# EAGLE design PC104 ISA TEMPLATE (EAGLE 8.5.0)
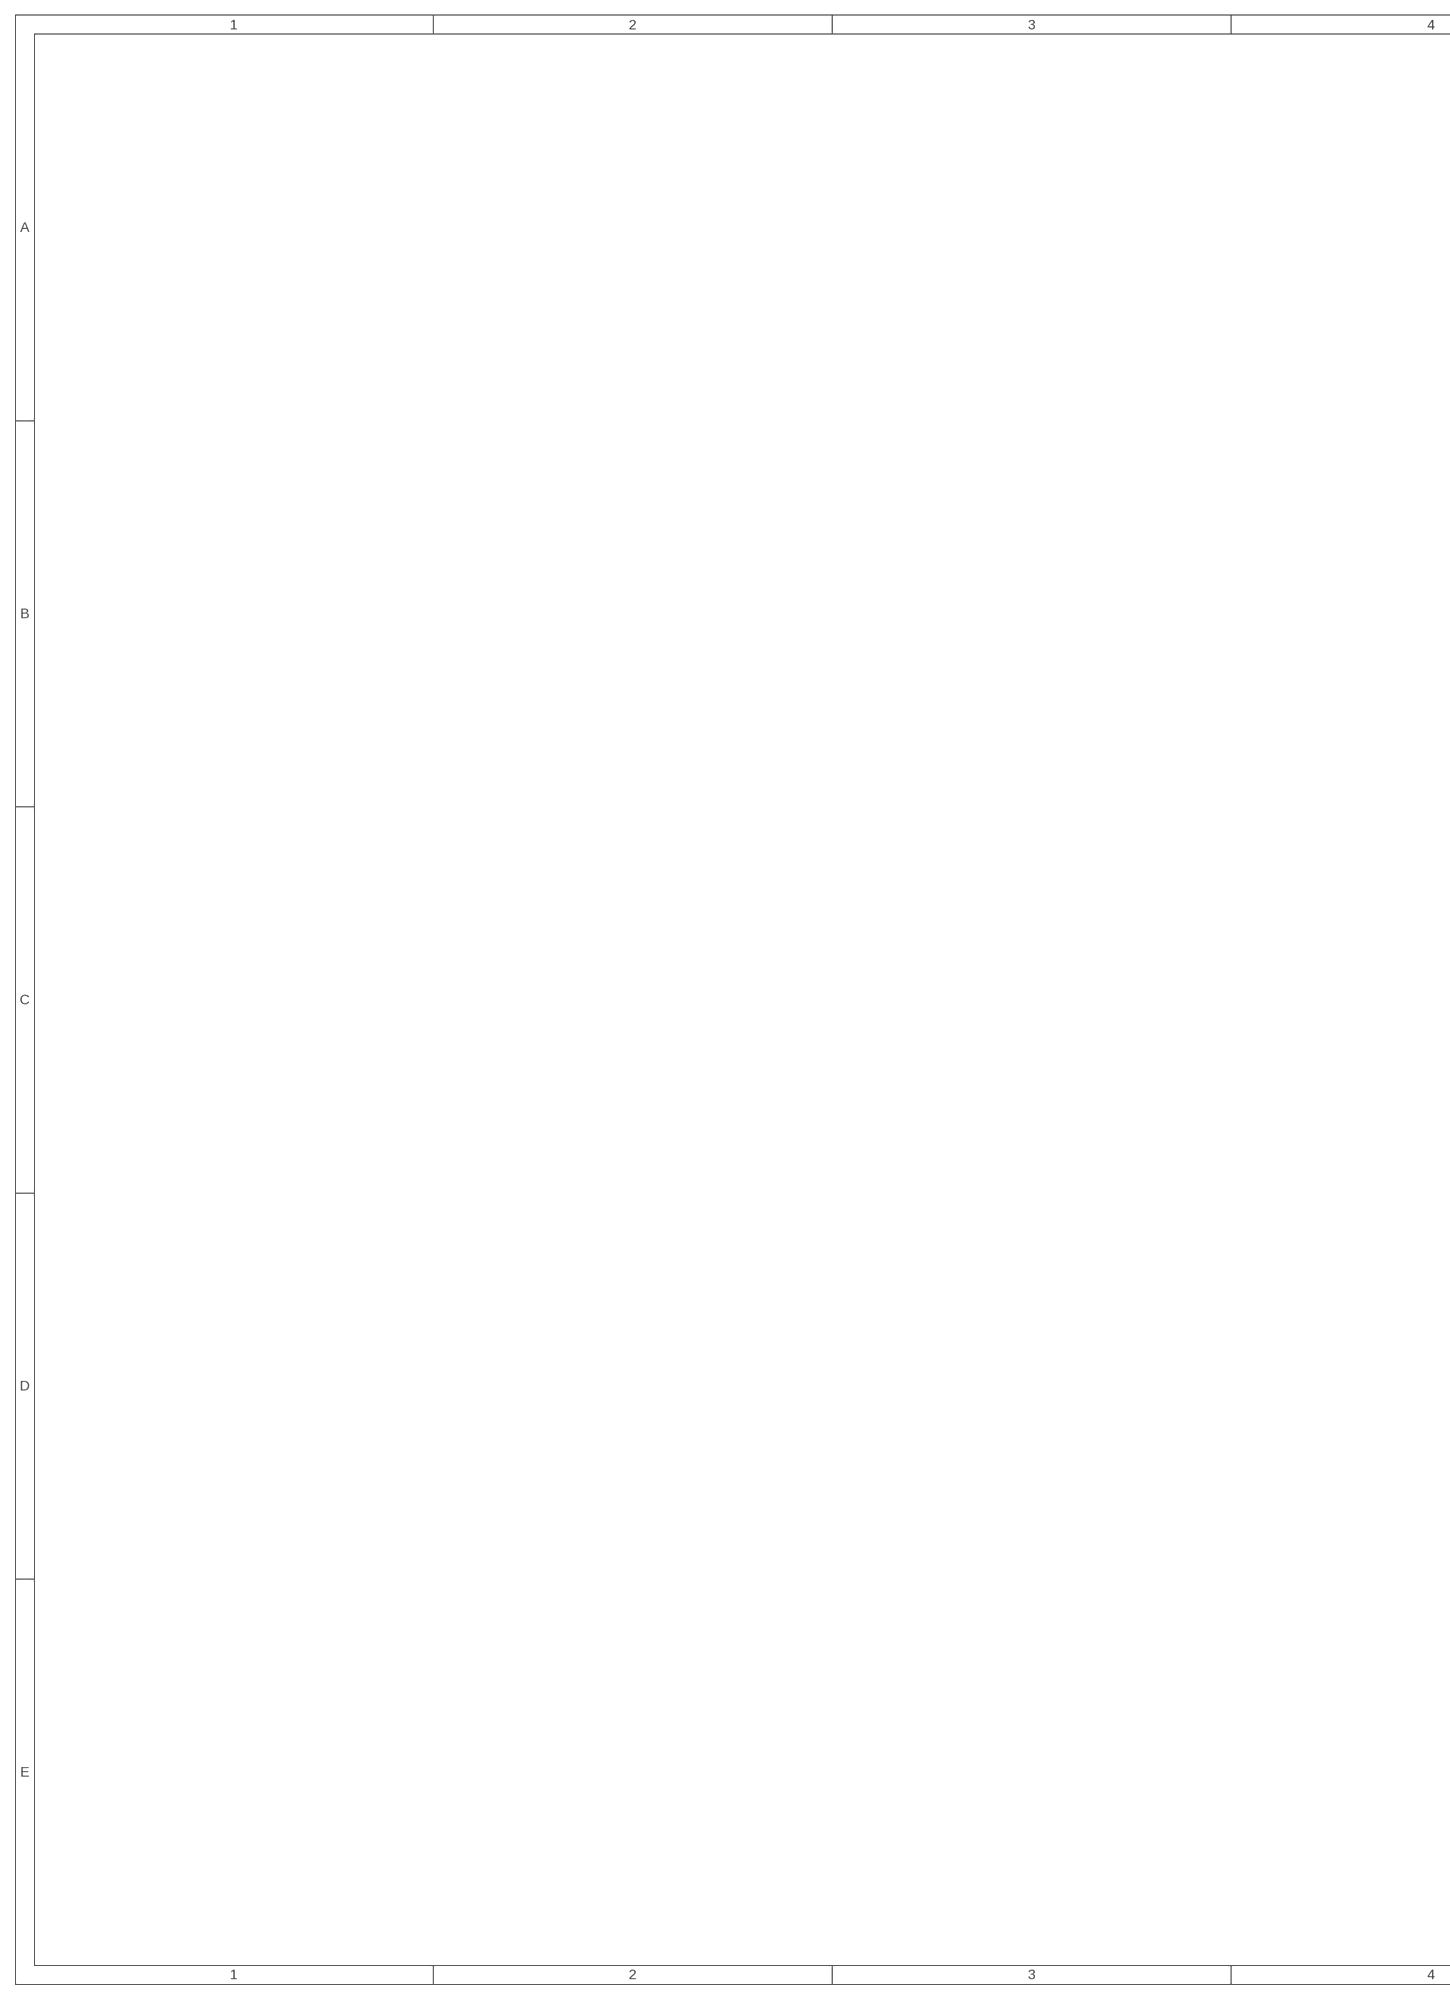
[diagram p0: schematic, sheet 1, part 1 of 2]
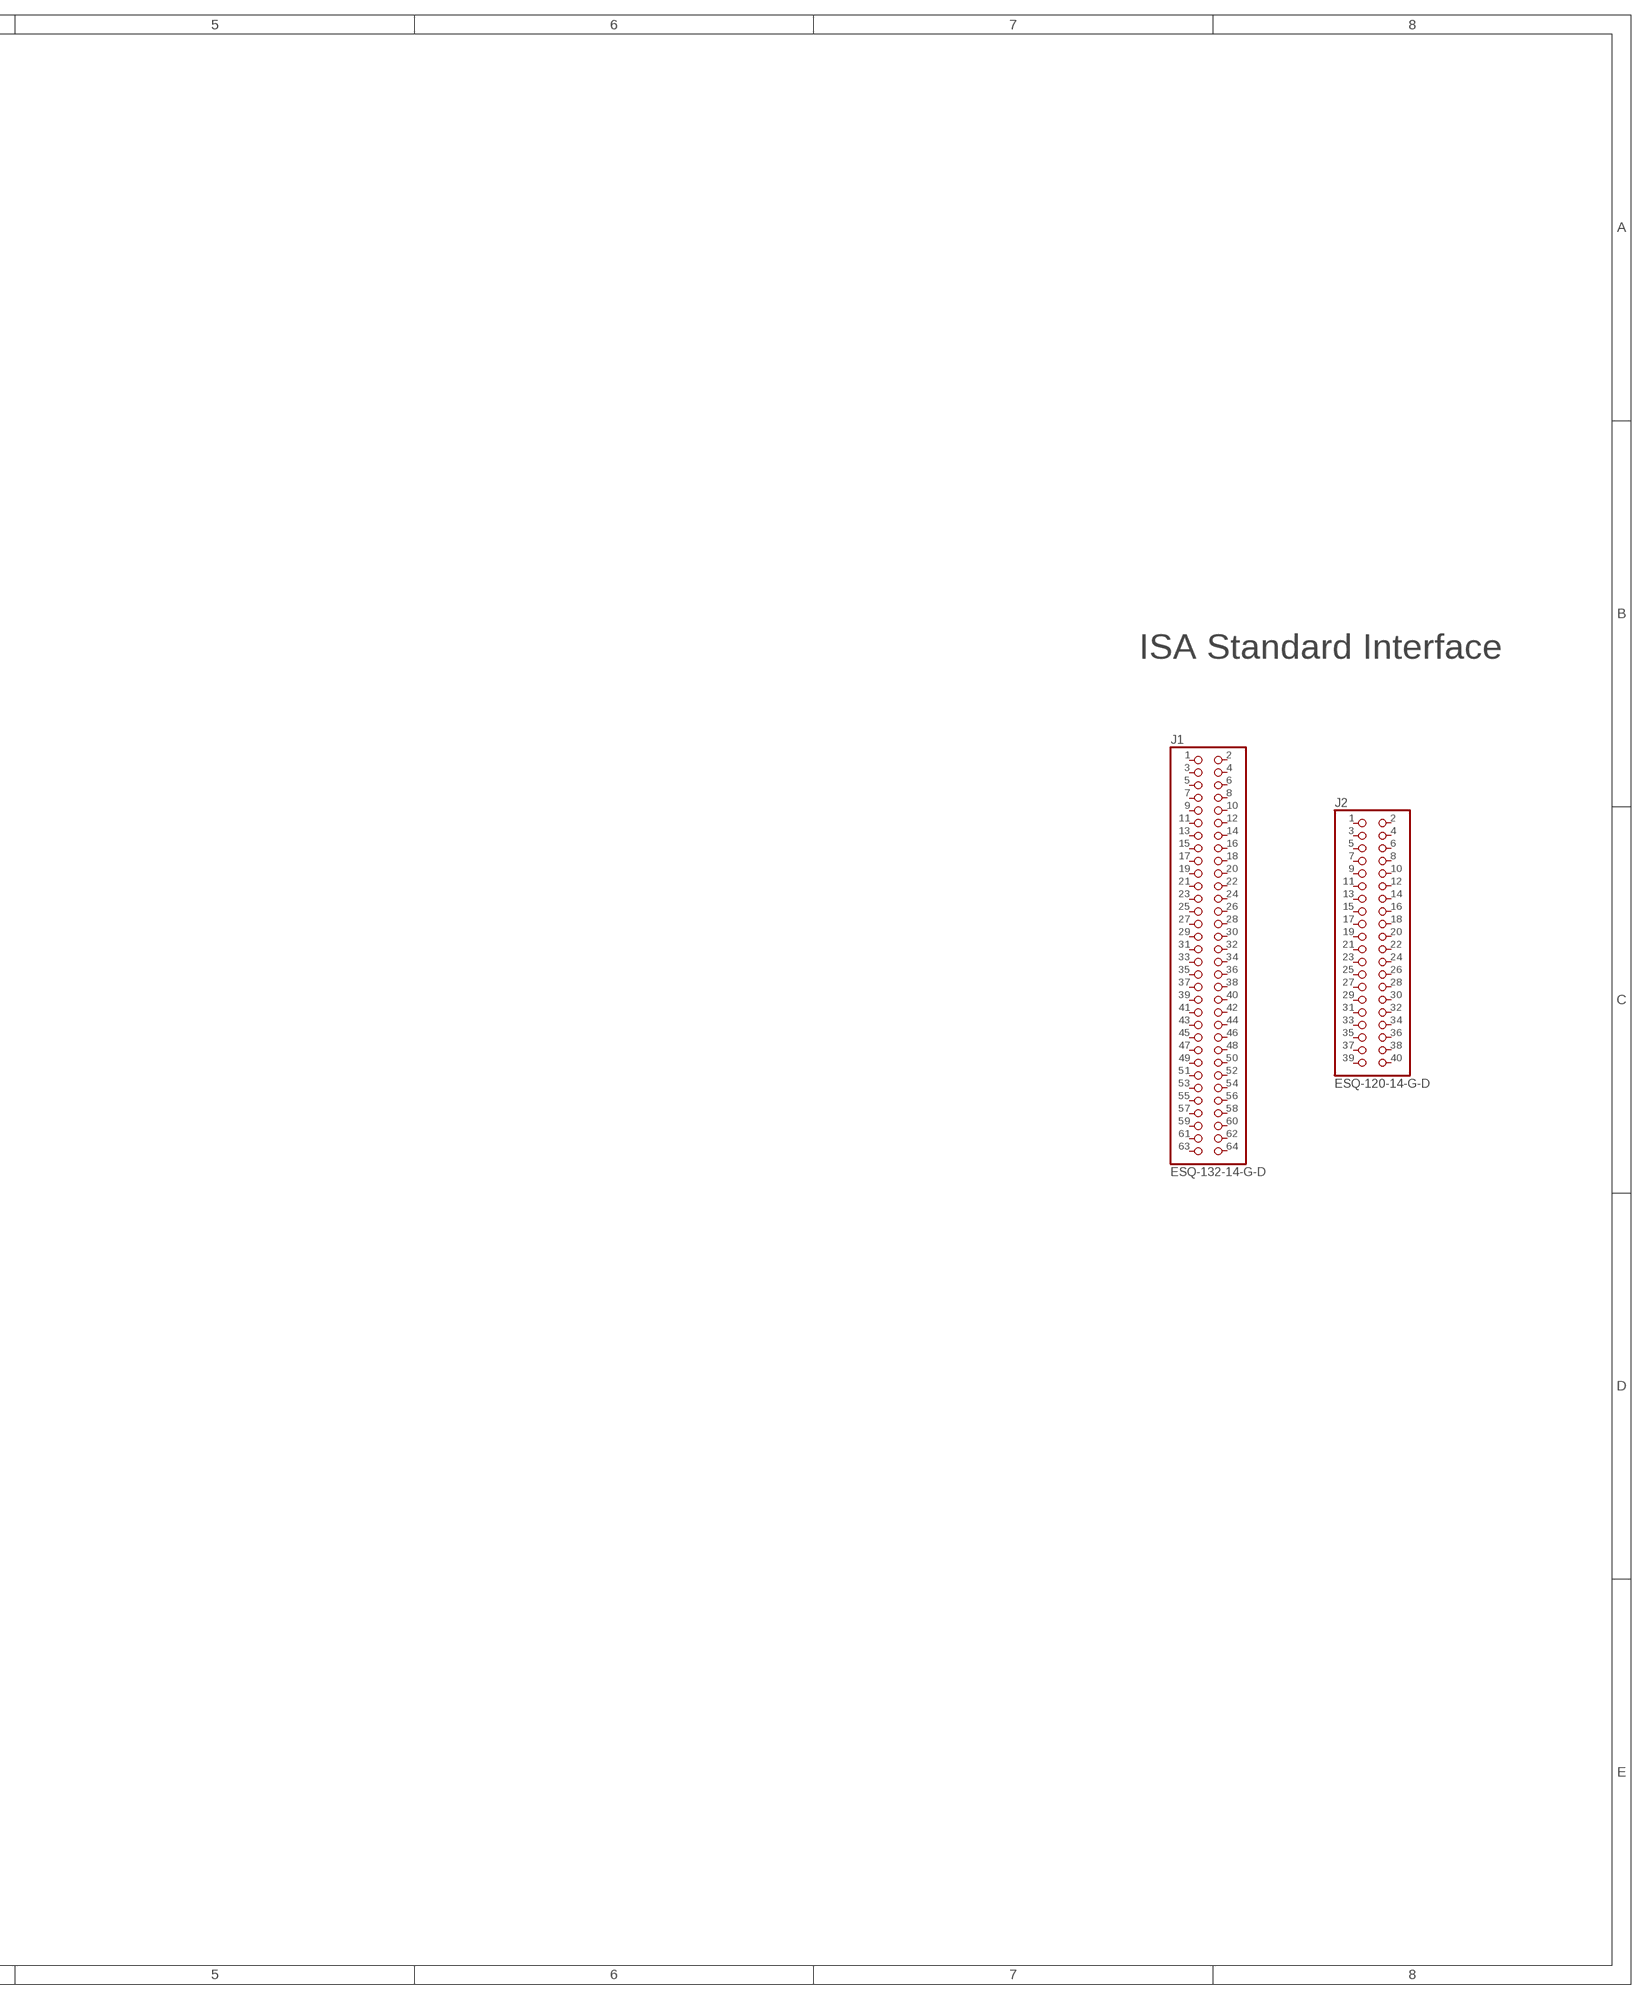
[diagram p1: schematic, sheet 1, part 2 of 2]

## Parts
J1  ESQ-132-14-G-D  [2X32]
J2  ESQ-120-14-G-D  [2X20]
Unconnected: J1.1 J1.2 J1.3 J1.4 J1.5 J1.6 J1.7 J1.8 J1.9 J1.10 J1.11 J1.12 J1.13 J1.14 J1.15 J1.16 J1.17 J1.18 J1.19 J1.20 J1.21 J1.22 J1.23 J1.24 J1.25 J1.26 J1.27 J1.28 J1.29 J1.30 J1.31 J1.32 J1.33 J1.34 J1.35 J1.36 J1.37 J1.38 J1.39 J1.40 J1.41 J1.42 J1.43 J1.44 J1.45 J1.46 J1.47 J1.48 J1.49 J1.50 J1.51 J1.52 J1.53 J1.54 J1.55 J1.56 J1.57 J1.58 J1.59 J1.60 J1.61 J1.62 J1.63 J1.64 J2.1 J2.2 J2.3 J2.4 J2.5 J2.6 J2.7 J2.8 J2.9 J2.10 J2.11 J2.12 J2.13 J2.14 J2.15 J2.16 J2.17 J2.18 J2.19 J2.20 J2.21 J2.22 J2.23 J2.24 J2.25 J2.26 J2.27 J2.28 J2.29 J2.30 J2.31 J2.32 J2.33 J2.34 J2.35 J2.36 J2.37 J2.38 J2.39 J2.40

## Notes on the sheet
- ISA Standard Interface

## Library data of the parts
J1 = Parts:ESQ-132-14-G-D
J2 = Parts:ESQ-120-14-G-D

## Board
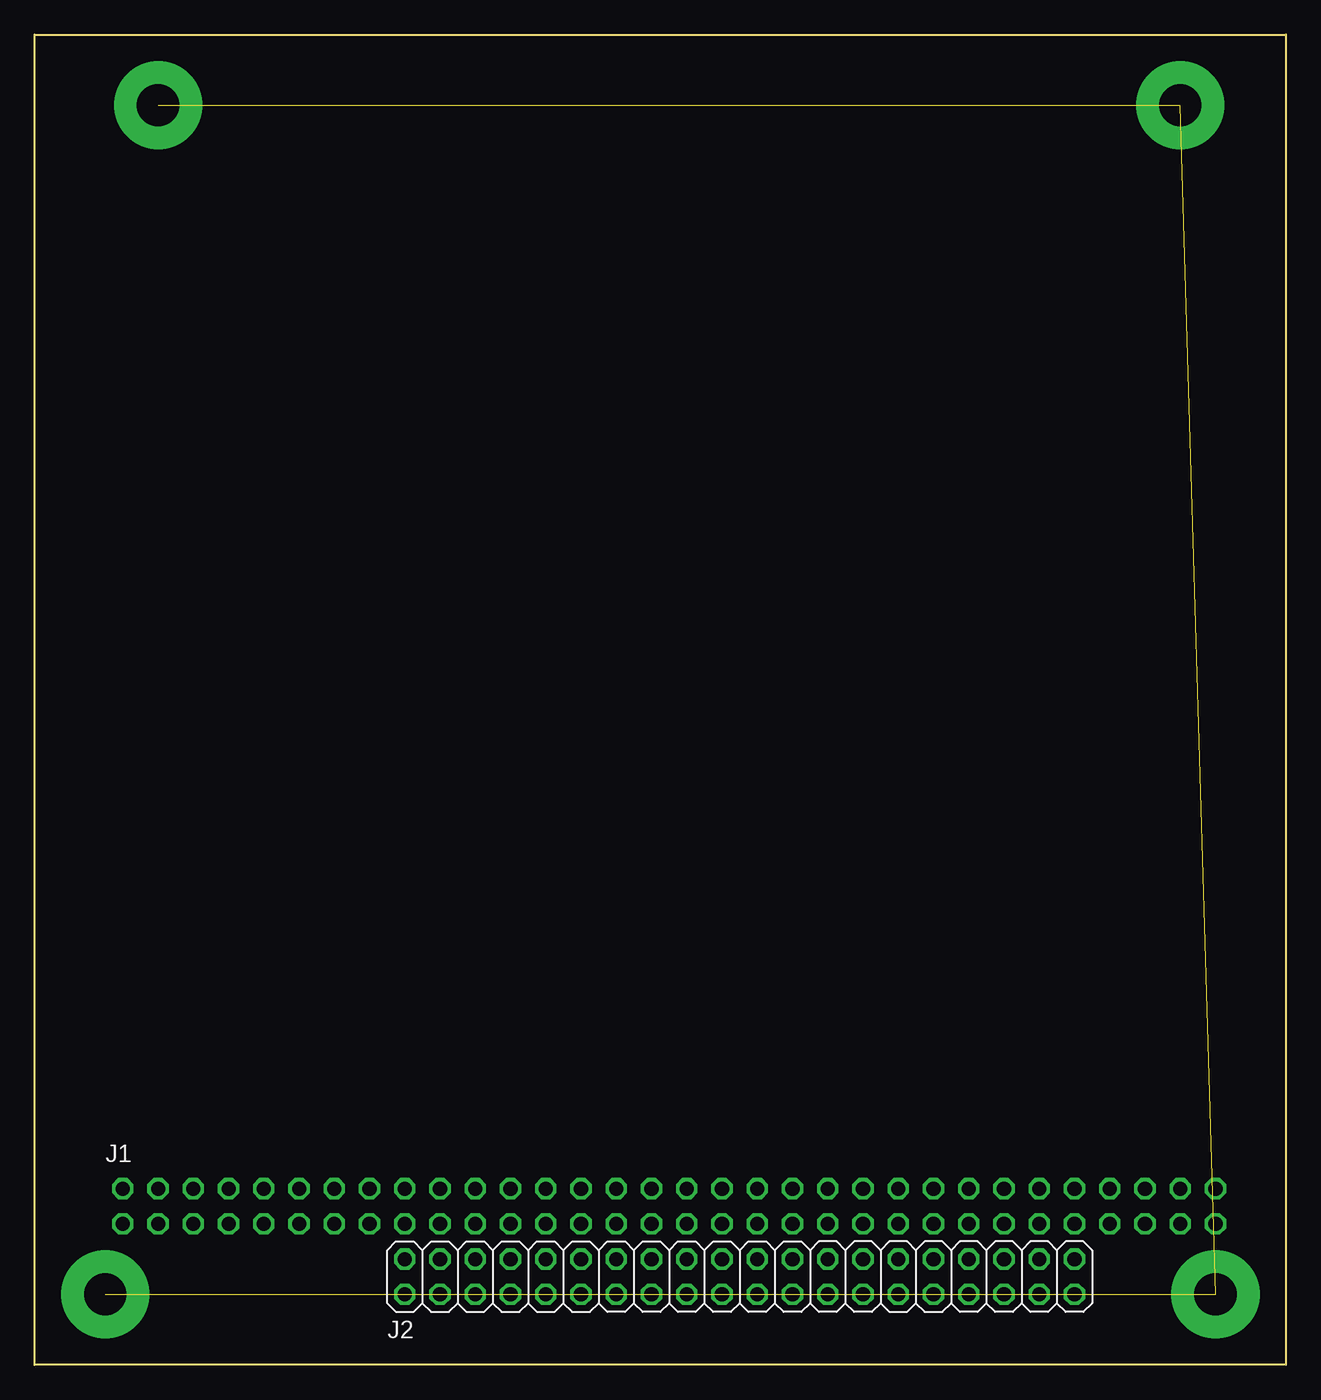
[diagram p2: board, top side]
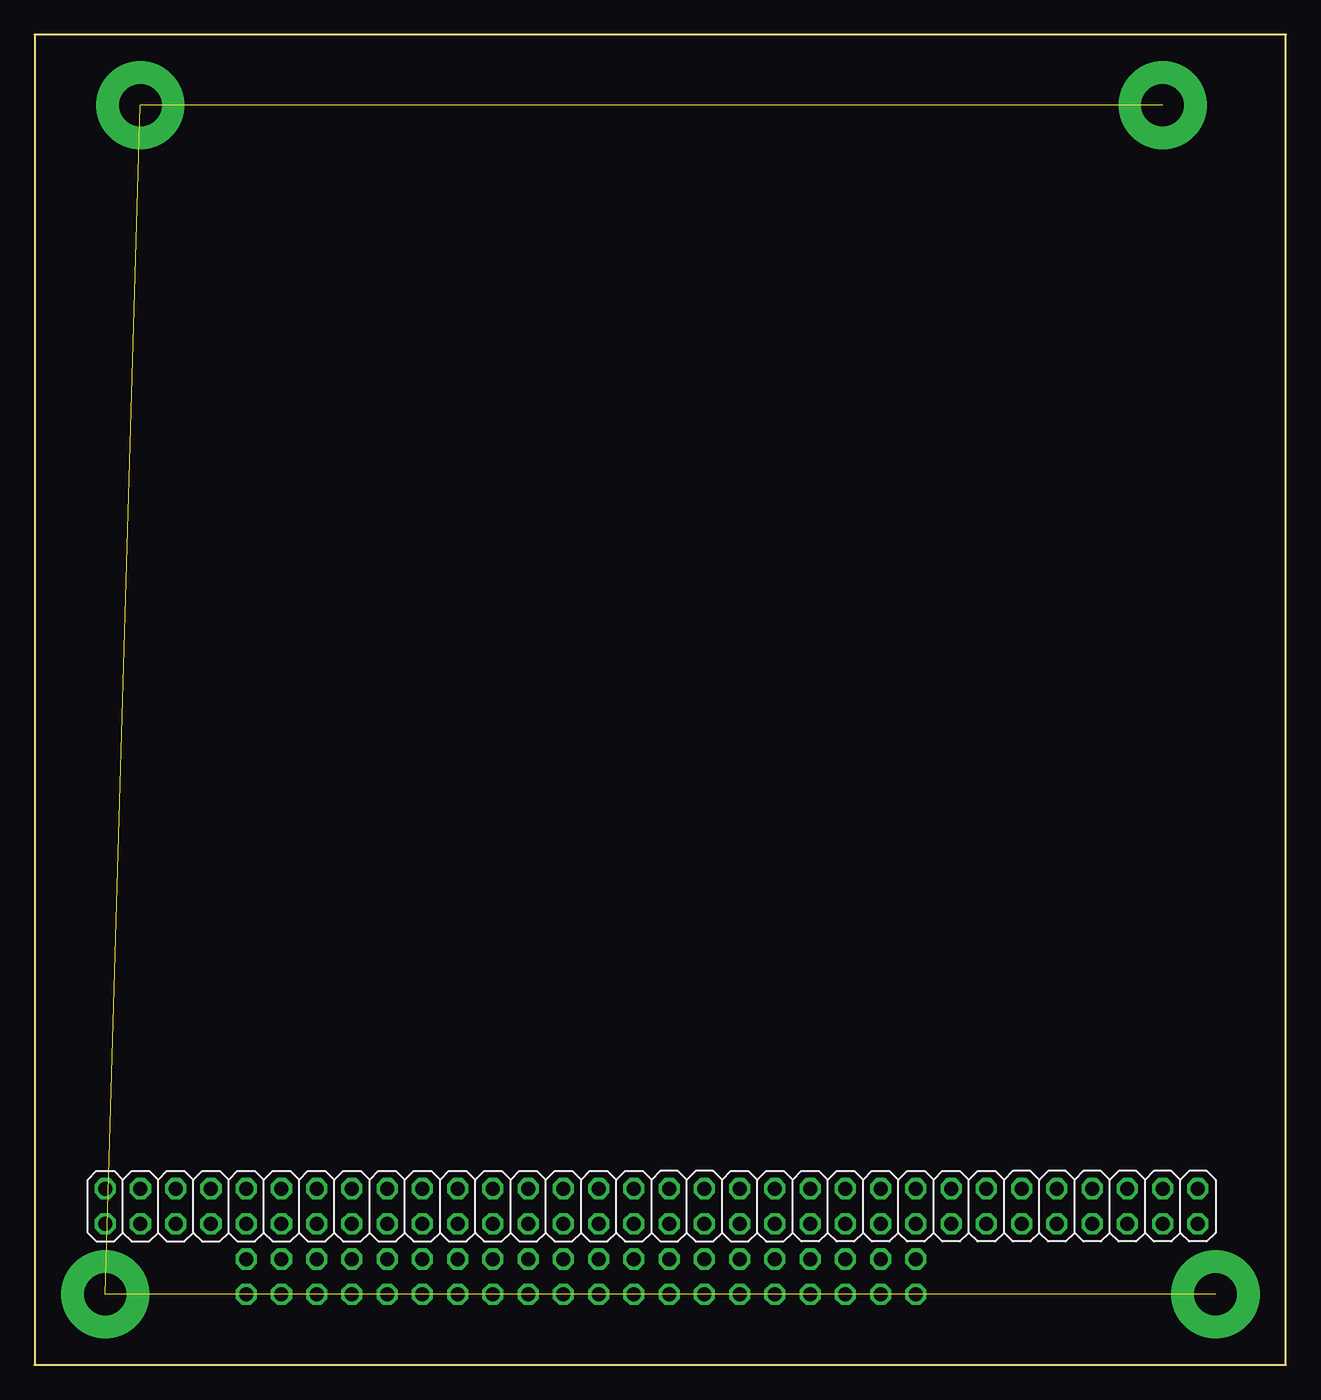
[diagram p3: board, bottom side, seen from below]

Size 90.17 x 95.89 mm. Coordinates in mm from the lower left corner, seen from the top.
Outline: 0,0 0,95.89 90.17,95.89 90.17,0 0,0
Copper layers (1*16): Top 0.035mm / dielectric 1.5mm / Bottom 0.035mm
Design rules "default": minimum track width 6mil, minimum drill 0.35mm, track to track 6mil, track to pad 6mil, pad to pad 6mil, via to via 6mil, smd to smd 6mil, copper to edge 40mil, drill to drill 6mil, minimum pad ring 10mil, minimum via ring 8mil, stop-mask expansion 4mil, vias tented up to drill 0mil, thermal gap 10mil

### Footprints (pad centres in the part's own frame; a part is rotated, then mirrored left to right if it is on the bottom)
2X32 = drill 1.016 octagon: 1 -38.1,-1.27; 2 -38.1,1.27; 3 -35.56,-1.27; 4 -35.56,1.27; 5 -33.02,-1.27; 6 -33.02,1.27; 7 -30.48,-1.27; 8 -30.48,1.27; 9 -27.94,-1.27; 10 -27.94,1.27; 11 -25.4,-1.27; 12 -25.4,1.27; 13 -22.86,-1.27; 14 -22.86,1.27; 15 -20.32,-1.27; 16 -20.32,1.27; 17 -17.78,-1.27; 18 -17.78,1.27; 19 -15.24,-1.27; 20 -15.24,1.27; 21 -12.7,-1.27; 22 -12.7,1.27; 23 -10.16,-1.27; 24 -10.16,1.27; 25 -7.62,-1.27; 26 -7.62,1.27; 27 -5.08,-1.27; 28 -5.08,1.27; 29 -2.54,-1.27; 30 -2.54,1.27; 31 0,-1.27; 32 0,1.27; 33 2.54,-1.27; 34 2.54,1.27; 35 5.08,-1.27; 36 5.08,1.27; 37 7.62,-1.27; 38 7.62,1.27; 39 10.16,-1.27; 40 10.16,1.27; 41 12.7,-1.27; 42 12.7,1.27; 43 15.24,-1.27; 44 15.24,1.27; 45 17.78,-1.27; 46 17.78,1.27; 47 20.32,-1.27; 48 20.32,1.27; 49 22.86,-1.27; 50 22.86,1.27; 51 25.4,-1.27; 52 25.4,1.27; 53 27.94,-1.27; 54 27.94,1.27; 55 30.48,-1.27; 56 30.48,1.27; 57 33.02,-1.27; 58 33.02,1.27; 59 35.56,-1.27; 60 35.56,1.27; 61 38.1,-1.27; 62 38.1,1.27; 63 40.64,-1.27; 64 40.64,1.27
2X20 = drill 1.016 octagon: 1 -24.13,-1.27; 2 -24.13,1.27; 3 -21.59,-1.27; 4 -21.59,1.27; 5 -19.05,-1.27; 6 -19.05,1.27; 7 -16.51,-1.27; 8 -16.51,1.27; 9 -13.97,-1.27; 10 -13.97,1.27; 11 -11.43,-1.27; 12 -11.43,1.27; 13 -8.89,-1.27; 14 -8.89,1.27; 15 -6.35,-1.27; 16 -6.35,1.27; 17 -3.81,-1.27; 18 -3.81,1.27; 19 -1.27,-1.27; 20 -1.27,1.27; 21 1.27,-1.27; 22 1.27,1.27; 23 3.81,-1.27; 24 3.81,1.27; 25 6.35,-1.27; 26 6.35,1.27; 27 8.89,-1.27; 28 8.89,1.27; 29 11.43,-1.27; 30 11.43,1.27; 31 13.97,-1.27; 32 13.97,1.27; 33 16.51,-1.27; 34 16.51,1.27; 35 19.05,-1.27; 36 19.05,1.27; 37 21.59,-1.27; 38 21.59,1.27; 39 24.13,-1.27; 40 24.13,1.27

### Placement (x,y rotation side)
J1  44.45,11.43 180 bottom
J2  50.8,6.35 0 top

### Tracks (layer width: path | path; a pad name or v marks a point on that pad's centre or on a via)
GND  (via drill 3.05 pad 6.35)  (3 unrouted)
  other vias: 8.89,90.81 82.55,90.81 5.08,5.08 85.09,5.08